# EasyEDA Pro project ProProject_STM32F407IGT6_2024-02-27.epro, schematic Schematic1
Create Date: 2023-11-24; Page Name: P1; Project Name: STM32F407IGT6; Schematic Name: Schematic1; Update Date: 2024-02-21; Company: 嘉立创EDA; Page Size: A3; Version: V1.0
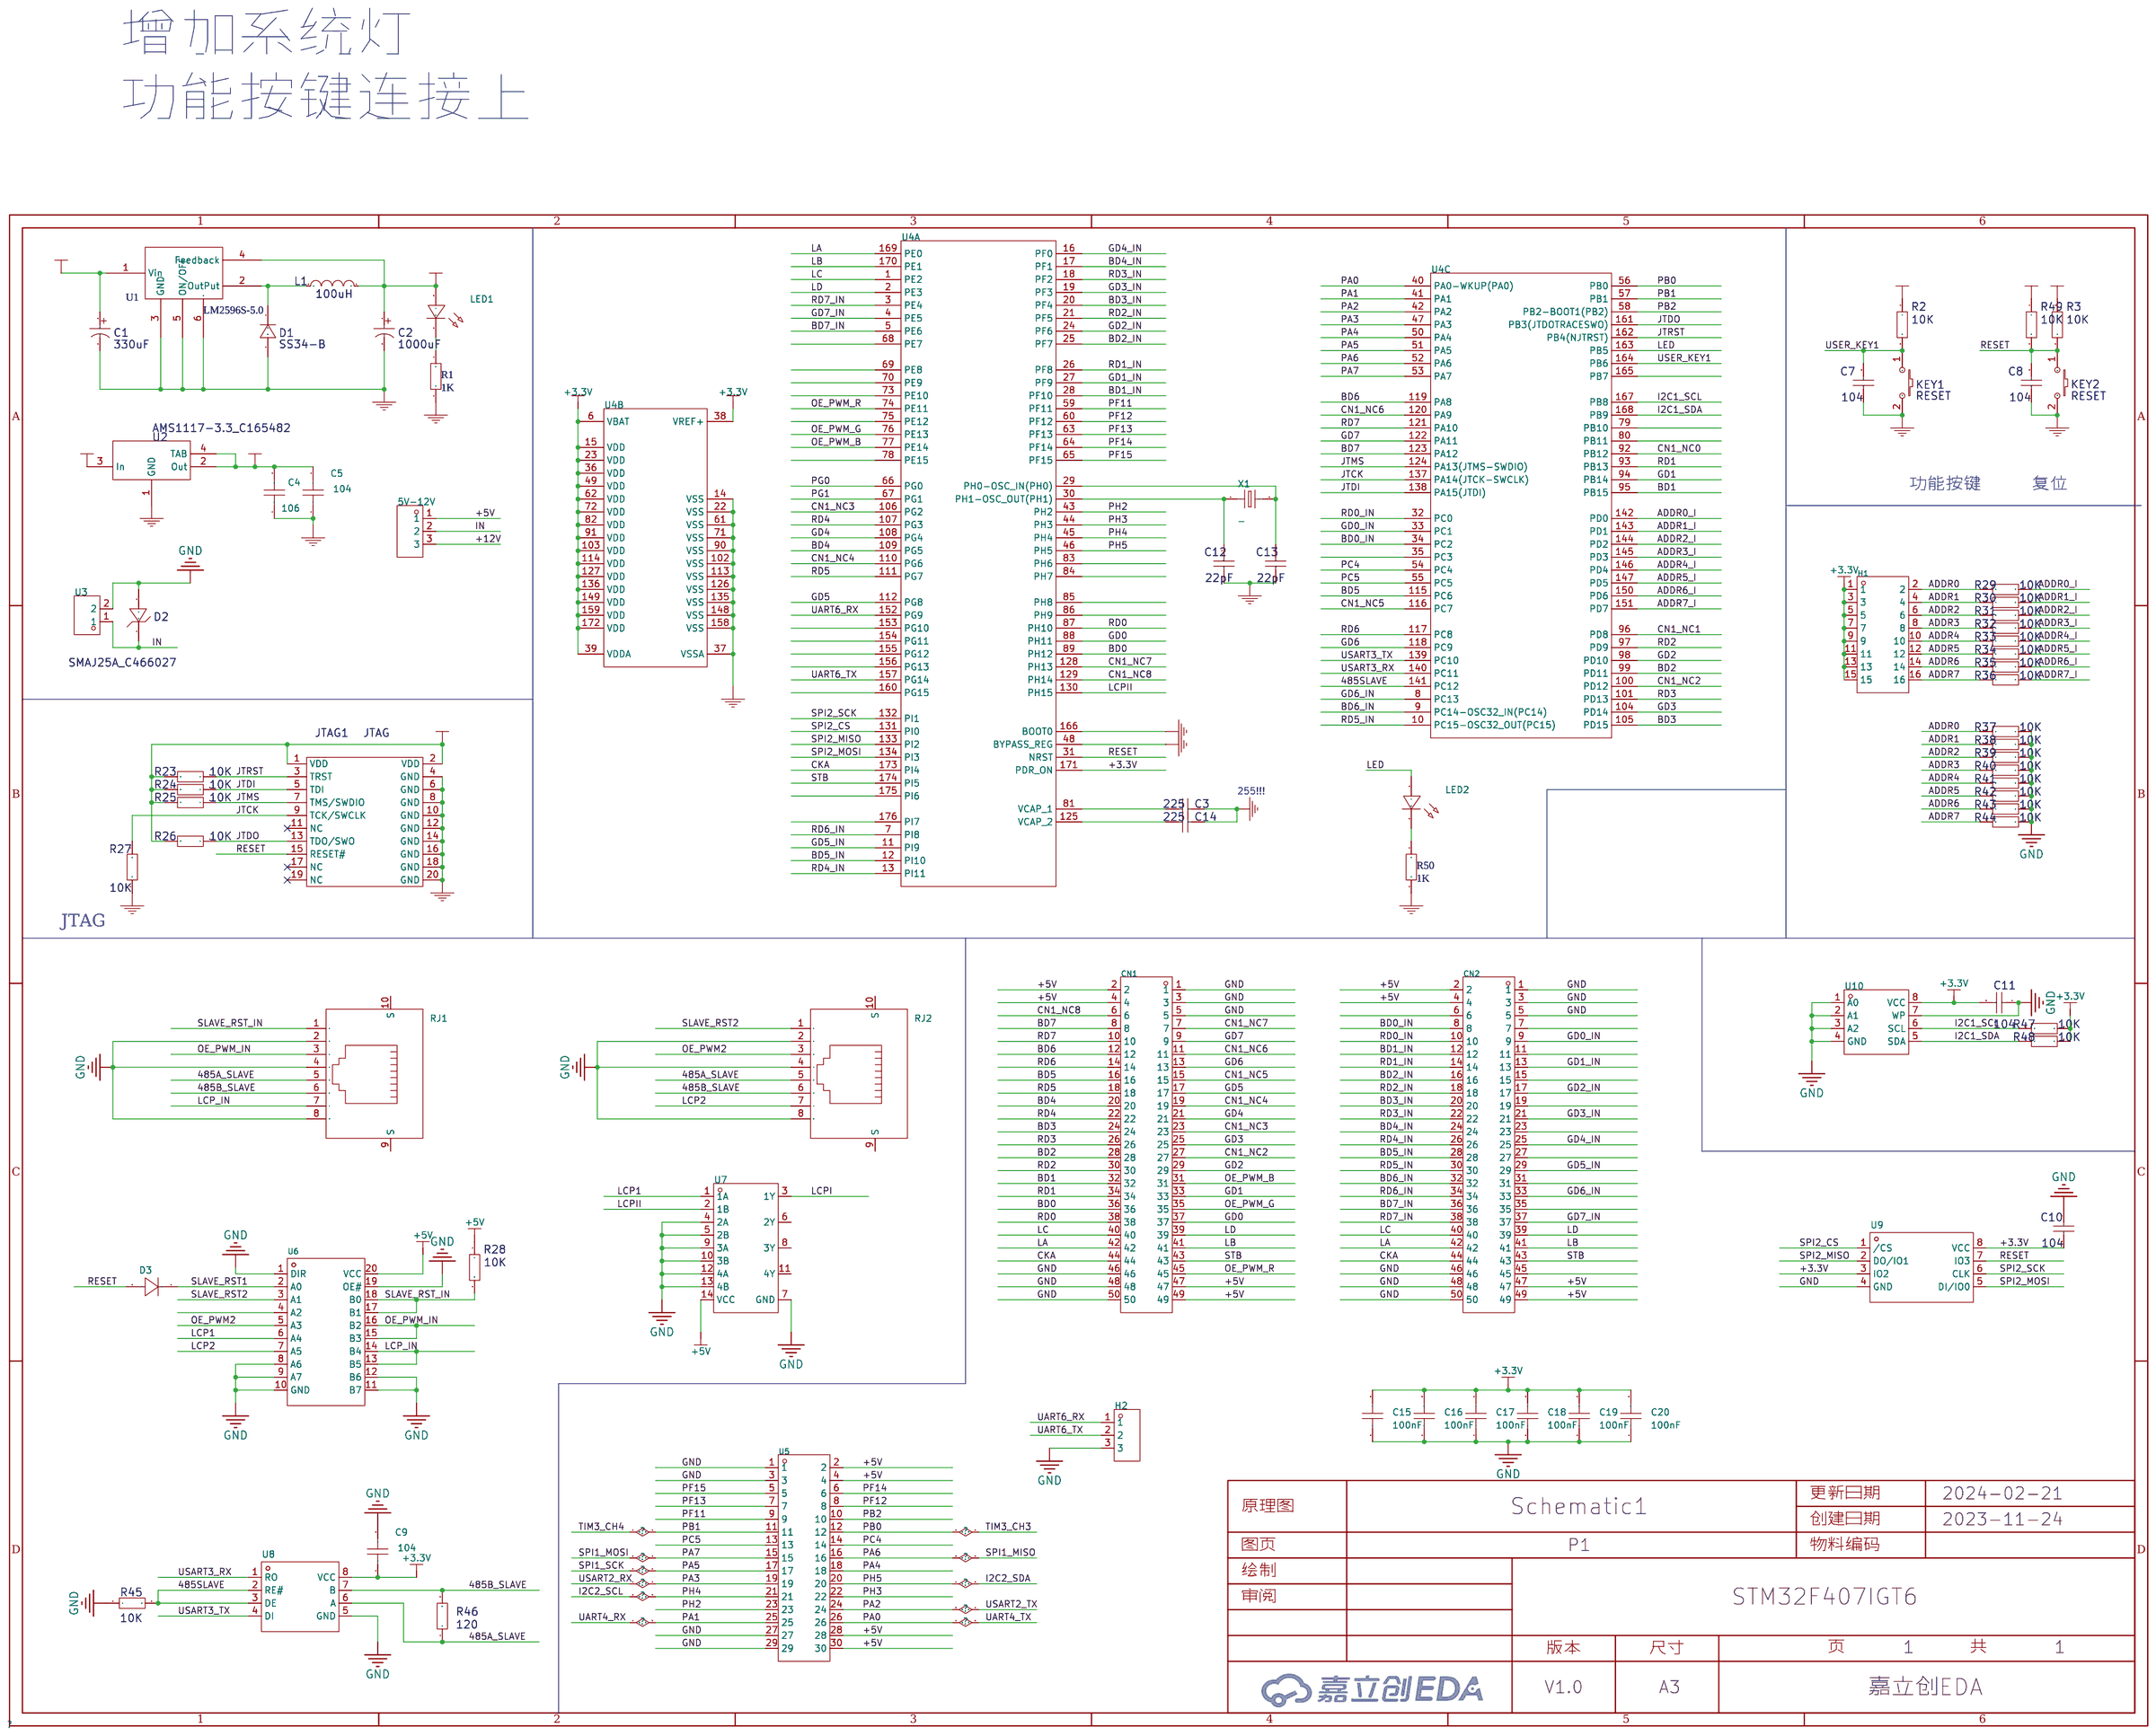
[diagram p0: schematic sheet]

## Parts
5V-12V  -  [HDR-TH_3P-P2.54-V-M]
C1  330uF  [直插电容C1]
C2  1000uF  [直插电容2]
C3  225  [C0805]
C4  106  [C0805]
C5  104  [C0805]
C7  104  [C0805]
C8  104  [C0805]
C9  104  [C0805]
C10  104  [C0805]
C11  104  [C0805]
C12  22pF  [C0805]
C13  22pF  [C0805]
C14  225  [C0805]
C15  100nF  [C0805]
C16  100nF  [C0805]
C17  100nF  [C0805]
C18  100nF  [C0805]
C19  100nF  [C0805]
C20  100nF  [C0805]
CN1  BH-00012  [IDC-TH_BH-00012]
CN2  BH-00012  [IDC-TH_BH-00012]
D1  SS34-B  [SMB_L4.6-W3.6-LS5.3-RD]
D2  SMAJ25A_C466027  [SMA_L4.4-W2.8-LS5.4-RD]
D3  1N4007  [SMA_L4.3-W2.5-LS5.0-RD]
H1  PZ254V-12-16P  [HDR-TH_16P-P2.54-V-M-R2-C8-S2.54]
H2  -  [HDR-TH_3P-P2.54-V-M]
JTAG1  JTAG  [JTAG_20]
KEY1  RESET  [按键]
KEY2  RESET  [按键]
L1  100uH  [IND-SMD_L12.0-W12.0_SLH1207S]
LED1  -  [LED0805-RD_RED]
LED2  -  [LED0805-RD_RED]
R1  1K  [R0805]
R2  10K  [R0805]
R3  10K  [R0805]
R23  10K  [R0805]
R24  10K  [R0805]
R25  10K  [R0805]
R26  10K  [R0805]
R27  10K  [R0805]
R28  10K  [R0805]
R29  10K  [R0805]
R30  10K  [R0805]
R31  10K  [R0805]
R32  10K  [R0805]
R33  10K  [R0805]
R34  10K  [R0805]
R35  10K  [R0805]
R36  10K  [R0805]
R37  10K  [R0805]
R38  10K  [R0805]
R39  10K  [R0805]
R40  10K  [R0805]
R41  10K  [R0805]
R42  10K  [R0805]
R43  10K  [R0805]
R44  10K  [R0805]
R45  10K  [R0805]
R46  120  [R0805]
R47  10K  [R0805]
R48  10K  [R0805]
R49  10K  [R0805]
R50  1K  [R0805]
RJ1  R-RJ45R10P-B000  [RJ45-TH_R-RJ45R10P-B000]
RJ2  R-RJ45R10P-B000  [RJ45-TH_R-RJ45R10P-B000]
U1  LM2596S-5.0  [TO-263-5_L10.6-W9.6-P1.70-LS15.9-BR]
U2  AMS1117-3.3_C165482  [SOT-223_L6.5-W3.5-P2.30-LS7.0-BR]
U3  KF7.62-2P  [CONN-TH_2P-P7.62_KEFA_KF7.62-2P]
U4  STM32F407IET6  [LQFP-176_L24.0-W24.0-P0.50-LS26.0-BL]  (sections 1,2,3)
U5  ZX-IDC2.54-2-15PZZ  [IDC-TH_30P-P2.54_ZX-IDC2.54-2-15PZZ]
U6  74HC245D,653  [SOIC-20_L13.0-W7.6-P1.27-LS10.3-BL]
U7  74HC32D  [SOIC-14_L8.6-W3.8-P1.27-LS6.0-BL]
U8  MAX3485EESA+T  [SOIC-8_L4.9-W3.9-P1.27-LS6.0-BL]
U9  W25Q16JVSSIQ  [SOIC-8_L5.3-W5.3-P1.27-LS8.0-BL]
U10  AT24C02  [SOP-8_L5.0-W4.0-P1.27-LS6.0-BL]
X1  -  [HC-49US_L11.5-W4.5-P4.88]

## Library data of the parts
5V-12V H2 = HDR-M_2.54_1x3P: Supplier Part: C2937625; Supplier Footprint: 插件
C1 = 330uF
C2 = 1000uF
C3 C14 = 225
C4 C5 C9 = CAP_0805: 容值:100nF;精度:±10%;额定电压:50V;温度系数:X7R;; Supplier Footprint: 0805
C7 C8 C10 C11 = 104
C12 C13 = 22
C15-C20 = CAP_0805: Supplier Footprint: 0805
CN1 CN2 = BH-00012: 连接器类型:简牛座;间距:2.54mm;每排PIN数:25;排数:2;行距:2.54mm;封装形式:直插;额定电流:3A;额定电压:-;工作温度范围:-40℃~+105℃;; LCSC Part Name: 2.54mm 每排P数:25 排数:2; Supplier Part: C2685056; Manufacturer: Liansheng(连盛); Supplier Footprint: 直插,P=2.54mm; JLCPCB Part Class: 扩展库; Supplier: LCSC; Connector Type: 简牛座; Pitch: 2.54mm; Pin Number in each Row: 25; Number of Rows: 2; Row Spacing: 2.54mm; Holder Type: 直插; Current Rating (Max): 3A; Operating Temperature Range: -40℃~+105℃
D1 = SS34-B
D2 = SMAJ36A_C466027
D3 = 1N4007_C727081: 二极管配置:独立式;正向压降(Vf):1.1V@1A;直流反向耐压(Vr):1kV;平均整流电流(Io):1A;; LCSC Part Name: 电压:1kV 电流:1A; Supplier Part: C727081; Manufacturer: TWGMC(台湾迪嘉); Supplier Footprint: SMA(DO-214AC); JLCPCB Part Class: Extended Part; Datasheet: https://atta.szlcsc.com/upload/public/pdf/source/20200828/C727079_3A05254382567072883400655AE0ED46.pdf; Supplier: LCSC; Diode Configuration: 独立式; Forward Voltage (Vf@If): 1.1V@1A; Reverse Voltage (Vr): 1kV; Average Rectified Current (Io): 1A; Reverse Leakage Current: 5uA@1kV
H1 = PZ254V-12-16P: 排数:双排;总PIN位数:16P;间距:2.54mm;插针结构:2x8P;行距:2.54mm;安装类型:直插;圆针/方针:方针;额定电流:-;额定电压:-;配合针长度:6mm;塑高:2.5mm;端接针长度:3mm;触头材质:黄铜;触头镀层:-;工作温度范围:-40℃~+105℃;颜色:黑色;; LCSC Part Name: 2.54mm 2x8P 直插 方针; Supplier Part: C492425; Manufacturer: XFCN(兴飞); Supplier Footprint: 插件,P=2.54mm; JLCPCB Part Class: Extended Part; Datasheet: https://atta.szlcsc.com/upload/public/pdf/source/20200309/C492425_0A00EE06259AD0A0AB9C88167BB69964.pdf; Supplier: LCSC; Number of Rows: 双排; Number of Pins: 16P; Pitch: 2.54mm; Pin Structure: 2x8P; Row Spacing: 2.54mm; Mounting Type: 直插; Circluar Pins/Square Pins: 方针; Length of Mating Pin: 6mm; Insulation Height: 2.5mm; Length of End Connection Pin: 3mm; Contact Material: 黄铜; Operating Temperature Range: -40℃~+105℃; Color: 黑色
JTAG1 = JTAG
KEY1 KEY2 = RESET: 制造商: 韩国韩荣
L1 = 100uH
LED1 LED2 = LED_0805-G: Supplier Footprint: 0805
R1 R50 = 1K: Published: 8-Jun-2000; LatestRevisionDate: 17-Jul-2002; LatestRevisionNote: Re-released for DXP Platform.; PackageReference: AXIAL-0.4; Publisher: Altium Limited
R2 R3 R23-R49 = 10K
RJ1 RJ2 = R-RJ45R10P-B000: 连接器类型:RJ插座;USOC代码:RJ45;端口数量:1;等级:-;安装方式:弯插;屏蔽:有屏蔽;LED:不带LED;工作温度范围:0℃~+70℃;; LCSC Part Name: RJ45 弯插 不带LED 10P/8C 铜壳带屏蔽 长体  无弹片 8PIN; Supplier Part: C386758; Manufacturer: Ckmtw(灿科盟); Supplier Footprint: 插件; JLCPCB Part Class: 扩展库; Datasheet: https://atta.szlcsc.com/upload/public/pdf/source/20190508/C386758_8CEE26A838080B089F94E7884BE94734.pdf; Supplier: LCSC; Connector Type: RJ插座; USOC Codes: RJ45; Number of Ports: 1; Mounting Style: 弯插; Shielding: 有屏蔽; LED: 不带LED; Operating Temperature Range: 0℃~+70℃
U1 = LM2596S-5.0
U2 = AMS1117-3.3_C165482
U3 = KF7.62-2P_C5173665: LCSC Part Name: 绿色尼龙环保; Supplier Part: C5173665; Manufacturer: KEFA(科发); Supplier Footprint: 插件,P=7.62mm; JLCPCB Part Class: Extended Part; Datasheet: https://atta.szlcsc.com/upload/public/pdf/source/20220915/0842C98F0805CE3BBD42ED115252704B.pdf; Supplier: LCSC
U4 = STM32F407IET6: CPU内核:ARM Cortex-M4;CPU最大主频:168MHz;程序存储容量:512KB;程序存储器类型:FLASH;RAM总容量:192KB;GPIO端口数量:140;; LCSC Part Name: ARM Cortex-M4 168MHz; Supplier Part: C96313; Manufacturer: ST(意法半导体); Supplier Footprint: LQFP-176(24x24); JLCPCB Part Class: 扩展库; Datasheet: https://atta.szlcsc.com/upload/public/pdf/source/20170707/1499421610637.pdf; Supplier: LCSC; CPU Core: ARM Cortex-M4; CPU Maximum Speed: 168MHz; Operating Voltage Range: 1.8V~3.6V; Program Storage Size: 512KB; Program Memory Type: FLASH; RAM Size: 192KB; GPIO Ports Number: 140; ADC (Bit): 12bit; DAC (Bit): 12bit; Universal Serial Bus: 有; Peripheral/Function: DMA；LCD/LED驱动; Watchdog: 有; Infrared Data Association: 有; Low-Voltage Detect: 有; LCD Module: 有; Direct Memory Access: 有; Internal Oscillator: 有; Operating Temperature Range: -40℃~+85℃
U5 = ZX-IDC2.54-2-15PZZ: 连接器类型:简牛座;间距:2.54mm;结构:2x15P;额定电流:3A;额定电压:1kV;封装形式:直插;行距:2.54mm;排数:2;每排PIN数:15;触头材质:黄铜;触头镀层:金;工作温度范围:-40℃~+105℃;焊接温度(最大值):260℃@10S;; LCSC Part Name: 2.54mm 2x15P 排数:2 每排P数:15; Supplier Part: C7501248; Manufacturer: Megastar(兆星); Supplier Footprint: 插件,P=2.54mm; Datasheet: https://atta.szlcsc.com/upload/public/pdf/source/20231122/459F800AA0F2D58DBB272BCD842D4D41.pdf; Supplier: LCSC; Connector Type: 简牛座; Pitch: 2.54mm; Structure: 2x15P; Current Rating (Max): 3A; Voltage Rating (Max): 1kV; Holder Type: 直插; Row Spacing: 2.54mm; Number of Rows: 2; Pin Number in each Row: 15; Contact Material: 黄铜; Contact Plating: 金; Operating Temperature Range: -40℃~+105℃; Soldering Temperature(Max): 260℃@10S
U6 = 74HC245D,653: 型号中的数字quot;653quot;只是厂家内部的一个编号而已。74HC245D商城上的图片产地仅供参考，以实际供货为准。; Supplier Part: C5625; Manufacturer: Nexperia(安世); Supplier Footprint: SOP-20-300mil; JLCPCB Part Class: 扩展库; Datasheet: https://atta.szlcsc.com/upload/public/pdf/source/20180326/C70245_56281BCF84F9E7641D2BBB6A629E618A.pdf; Supplier: LCSC
U7 = 74HC32D: 逻辑类型:或门;通道数:4;电源电压:2V~6V;静态电流(最大值):1uA;最大传播延迟:13ns@6V,50pF;; Supplier Part: C4468690; Manufacturer: TOSHIBA(东芝); Supplier Footprint: SOP-14; JLCPCB Part Class: 扩展库; Supplier: LCSC; Series: 74HC; Logic Gate Type: 或门; Number of Channels: 4; Supply Voltage: 2V~6V; Quiescent Current (Max): 1uA; Sink Current: 5.2mA; Source Current: 5.2mA; High Level Range (VIH): 1.5V~4.2V; Low Level Range (VIL): 500mV~1.8V; Propagation Delay Time: 13ns@6V,50pF; Operating Temperature: -40℃~+125℃
U8 = MAX3485EESA+T: 类型:收发器;驱动器/接收器:1/1;数据速率:12Mbps;; LCSC Part Name: 3.3V供电 12Mbps 收发器; Supplier Part: C9943; Manufacturer: ADI(亚德诺)/MAXIM(美信); Supplier Footprint: SOP-8; JLCPCB Part Class: Extended Part; Datasheet: https://atta.szlcsc.com/upload/public/pdf/source/20121117/1457706559058.pdf; Supplier: LCSC; Types: 收发器; Driver/receiver: 1/1; Data Rate: 12Mbps; Supply Voltage: 3V~3.6V; Operating Temperature: -40℃~+85℃
U9 = W25Q16JVSSIQ: 接口类型:SPI;存储容量:16Mbit;; Supplier Part: C82317; Manufacturer: WINBOND(华邦); Supplier Footprint: SOIC-8-208mil; JLCPCB Part Class: Extended Part; Datasheet: https://atta.szlcsc.com/upload/public/pdf/source/20210318/C131025_490139441AABAB3970D06D5A0D9163A5.pdf; Supplier: LCSC; Interface Type: SPI; Memory Size: 16Mbit; Supply Voltage: 2.7V~3.6V; Page Programming Time (Tpp): 3ms; Operating Temperature: -40℃~+85℃
U10 = AT24C02_C688857: Supplier Part: C688857; Manufacturer: IDCHIP(英锐芯); Supplier Footprint: SOP-8; JLCPCB Part Class: Extended Part; Datasheet: https://atta.szlcsc.com/upload/public/pdf/source/20200619/C688857_168265888F77B455D6D4136881F4BB15.pdf; Supplier: LCSC
X1 = XIHCELNANF-25MHZ: 晶振类型:-;频率:-;频率公差:-;负载电容:-;工作温度:-;; LCSC Part Name: 25MHZ 20PF30PPM -40~+85DIP; Supplier Part: C295079; Manufacturer: TAITIEN(泰艺电子); Supplier Footprint: HC-49S-2P; JLCPCB Part Class: Extended Part; Datasheet: https://atta.szlcsc.com/upload/public/pdf/source/20180928/C295079_2C551BCED97315E6FEC0145316AF7D5F.pdf; Supplier: LCSC

## Nets
+3.3V: C4.2 C5.2 C9.1 C10.2 C11.2 C15.2 C16.2 C17.2 C18.2 C19.2 C20.2 H1.1 H1.3 H1.5 H1.7 H1.9 H1.11 H1.13 H1.15 JTAG1.1(VDD) JTAG1.2(VDD) R2.1 R3.1 R23.2 R24.2 R25.2 R26.2 R47.2 R48.2 R49.1 U2.2(Out) U2.4(TAB) U4.6(VBAT) U4.15(VDD) U4.23(VDD) U4.36(VDD) U4.38(VREF+) U4.39(VDDA) U4.49(VDD) U4.62(VDD) U4.72(VDD) U4.82(VDD) U4.91(VDD) U4.103(VDD) U4.114(VDD) U4.127(VDD) U4.136(VDD) U4.149(VDD) U4.159(VDD) U4.171(PDR_ON) U4.172(VDD) U8.8(VCC) U9.3(IO2) U9.8(VCC) U10.8(VCC)
+5V: 5V-12V.1 C2.1 CN1.2 CN1.4 CN1.47 CN1.49 CN2.2 CN2.4 CN2.47 CN2.49 L1.2 LED1.2(A) R28.1 U1.4(Feedback) U2.3(In) U5.2 U5.4 U5.28 U5.30 U6.20(VCC) U7.14(VCC)
+12V: 5V-12V.3 C1.1 U1.1(Vin)
GND: C1.2 C2.2 C3.1 C4.1 C5.1 C7.2 C8.2 C9.2 C10.1 C11.1 C12.1 C13.1 C14.1 C15.1 C16.1 C17.1 C18.1 C19.1 C20.1 CN1.1 CN1.3 CN1.5 CN1.46 CN1.48 CN1.50 CN2.1 CN2.3 CN2.5 CN2.46 CN2.48 CN2.50 D1.2 D2.2(A) H2.3 JTAG1.4(GND) JTAG1.6(GND) JTAG1.8(GND) JTAG1.10(GND) JTAG1.12(GND) JTAG1.14(GND) JTAG1.16(GND) JTAG1.18(GND) JTAG1.20(GND) KEY1.2 KEY2.2 R1.2 R27.2 R37.2 R38.2 R39.2 R40.2 R41.2 R42.2 R43.2 R44.2 R45.1 R50.2 RJ1.2 RJ1.4 RJ1.8 RJ2.2 RJ2.4 RJ2.8 U1.3(GND) U1.5(ON/OFF) U1.6 U2.1(GND) U3.2 U4.14(VSS) U4.22(VSS) U4.37(VSSA) U4.48(BYPASS_REG) U4.61(VSS) U4.71(VSS) U4.90(VSS) U4.102(VSS) U4.113(VSS) U4.126(VSS) U4.135(VSS) U4.148(VSS) U4.158(VSS) U4.166(BOOT0) U5.1 U5.3 U5.27 U5.29 U6.1(DIR) U6.8(A6) U6.9(A7) U6.10(GND) U6.11(B7) U6.12(B6) U6.19(OE#) U7.4(2A) U7.5(2B) U7.7(GND) U7.9(3A) U7.10(3B) U7.12(4A) U7.13(4B) U8.5(GND) U9.4(GND) U10.1(A0) U10.2(A1) U10.3(A2) U10.4(GND) U10.7(WP)
485A_SLAVE: R46.1 RJ1.5 RJ2.5 U8.6(A)
485B_SLAVE: R46.2 RJ1.6 RJ2.6 U8.7(B)
485SLAVE: R45.2 U4.141(PC12) U8.2(RE#) U8.3(DE)
ADDR0: H1.2 R29.1 R37.1
ADDR0_I: R29.2 U4.142(PD0)
ADDR1: H1.4 R30.1 R38.1
ADDR1_I: R30.2 U4.143(PD1)
ADDR2: H1.6 R31.1 R39.1
ADDR2_I: R31.2 U4.144(PD2)
ADDR3: H1.8 R32.1 R40.1
ADDR3_I: R32.2 U4.145(PD3)
ADDR4: H1.10 R33.1 R41.1
ADDR4_I: R33.2 U4.146(PD4)
ADDR5: H1.12 R34.1 R42.1
ADDR5_I: R34.2 U4.147(PD5)
ADDR6: H1.14 R35.1 R43.1
ADDR6_I: R35.2 U4.150(PD6)
ADDR7: H1.16 R36.1 R44.1
ADDR7_I: R36.2 U4.151(PD7)
BD0: CN1.36 U4.89(PH12)
BD0_IN: CN2.8 U4.34(PC2)
BD1: CN1.32 U4.95(PB15)
BD1_IN: CN2.12 U4.28(PF10)
BD2: CN1.28 U4.99(PD11)
BD2_IN: CN2.16 U4.25(PF7)
BD3: CN1.24 U4.105(PD15)
BD3_IN: CN2.20 U4.20(PF4)
BD4: CN1.20 U4.109(PG5)
BD4_IN: CN2.24 U4.17(PF1)
BD5: CN1.16 U4.115(PC6)
BD5_IN: CN2.28 U4.12(PI10)
BD6: CN1.12 U4.119(PA8)
BD6_IN: CN2.32 U4.9(PC14-OSC32_IN(PC14))
BD7: CN1.8 U4.123(PA12)
BD7_IN: CN2.36 U4.5(PE6)
CKA: CN1.44 CN2.44 U4.173(PI4)
CN1_NC0: U4.92(PB12)
CN1_NC1: U4.96(PD8)
CN1_NC2: CN1.27 U4.100(PD12)
CN1_NC3: CN1.23 U4.106(PG2)
CN1_NC4: CN1.19 U4.110(PG6)
CN1_NC5: CN1.15 U4.116(PC7)
CN1_NC6: CN1.11 U4.120(PA9)
CN1_NC7: CN1.7 U4.128(PH13)
CN1_NC8: CN1.6 U4.129(PH14)
GD0: CN1.37 U4.88(PH11)
GD0_IN: CN2.9 U4.33(PC1)
GD1: CN1.33 U4.94(PB14)
GD1_IN: CN2.13 U4.27(PF9)
GD2: CN1.29 U4.98(PD10)
GD2_IN: CN2.17 U4.24(PF6)
GD3: CN1.25 U4.104(PD14)
GD3_IN: CN2.21 U4.19(PF3)
GD4: CN1.21 U4.108(PG4)
GD4_IN: CN2.25 U4.16(PF0)
GD5: CN1.17 U4.112(PG8)
GD5_IN: CN2.29 U4.11(PI9)
GD6: CN1.13 U4.118(PC9)
GD6_IN: CN2.33 U4.8(PC13)
GD7: CN1.9 U4.122(PA11)
GD7_IN: CN2.37 U4.4(PE5)
I2C1_SCL: R47.1 U4.167(PB8) U10.6(SCL)
I2C1_SDA: R48.1 U4.168(PB9) U10.5(SDA)
I2C2_SCL: U4.45(PH4) U5.21
I2C2_SDA: U4.46(PH5) U5.20
IN: 5V-12V.2 D2.1(C) U3.1
JTCK: JTAG1.9(TCK/SWCLK) R27.1 U4.137(PA14(JTCK-SWCLK))
JTDI: JTAG1.5(TDI) R24.1 U4.138(PA15(JTDI))
JTDO: JTAG1.13(TDO/SWO) R26.1 U4.161(PB3(JTDOTRACESWO))
JTMS: JTAG1.7(TMS/SWDIO) R25.1 U4.124(PA13(JTMS-SWDIO))
JTRST: JTAG1.3(TRST) R23.1 U4.162(PB4(NJTRST))
LA: CN1.42 CN2.42 U4.169(PE0)
LB: CN1.41 CN2.41 U4.170(PE1)
LC: CN1.40 CN2.40 U4.1(PE2)
LCP1: U6.6(A4) U7.1(1A)
LCP2: RJ2.7 U6.7(A5)
LCP_IN: RJ1.7 U6.13(B5) U6.14(B4)
LCPI: U7.3(1Y)
LCPII: U4.130(PH15) U7.2(1B)
LD: CN1.39 CN2.39 U4.2(PE3)
LED: LED2.2(A) U4.163(PB5)
OE_PWM2: RJ2.3 U6.5(A3)
OE_PWM_B: CN1.31 U4.77(PE14)
OE_PWM_G: CN1.35 U4.76(PE13)
OE_PWM_IN: RJ1.3 U6.15(B3) U6.16(B2)
OE_PWM_R: CN1.45 U4.74(PE11)
PA0: U4.40(PA0-WKUP(PA0)) U5.26
PA1: U4.41(PA1) U5.25
PA2: U4.42(PA2) U5.24
PA3: U4.47(PA3) U5.19
PA4: U4.50(PA4) U5.18
PA5: U4.51(PA5) U5.17
PA6: U4.52(PA6) U5.16
PA7: U4.53(PA7) U5.15
PB0: U4.56(PB0) U5.12
PB1: U4.57(PB1) U5.11
PB2: U4.58(PB2-BOOT1(PB2)) U5.10
PC4: U4.54(PC4) U5.14
PC5: U4.55(PC5) U5.13
PF11: U4.59(PF11) U5.9
PF12: U4.60(PF12) U5.8
PF13: U4.63(PF13) U5.7
PF14: U4.64(PF14) U5.6
PF15: U4.65(PF15) U5.5
PG0: U4.66(PG0)
PG1: U4.67(PG1)
PH2: U4.43(PH2) U5.23
PH3: U4.44(PH3) U5.22
RD0: CN1.38 U4.87(PH10)
RD0_IN: CN2.10 U4.32(PC0)
RD1: CN1.34 U4.93(PB13)
RD1_IN: CN2.14 U4.26(PF8)
RD2: CN1.30 U4.97(PD9)
RD2_IN: CN2.18 U4.21(PF5)
RD3: CN1.26 U4.101(PD13)
RD3_IN: CN2.22 U4.18(PF2)
RD4: CN1.22 U4.107(PG3)
RD4_IN: CN2.26 U4.13(PI11)
RD5: CN1.18 U4.111(PG7)
RD5_IN: CN2.30 U4.10(PC15-OSC32_OUT(PC15))
RD6: CN1.14 U4.117(PC8)
RD6_IN: CN2.34 U4.7(PI8)
RD7: CN1.10 U4.121(PA10)
RD7_IN: CN2.38 U4.3(PE4)
RESET: C8.1 D3.2(A) JTAG1.15(RESET#) KEY2.1 R3.2 R49.2 U4.31(NRST) U9.7(IO3)
SLAVE_RST1: D3.1(K) U6.2(A0)
SLAVE_RST2: RJ2.1 U6.3(A1)
SLAVE_RST_IN: R28.2 RJ1.1 U6.17(B1) U6.18(B0)
SPI2_CS: U4.131(PI0) U9.1(/CS)
SPI2_MISO: U4.133(PI2) U9.2(DO/IO1)
SPI2_MOSI: U4.134(PI3) U9.5(DI/IO0)
SPI2_SCK: U4.132(PI1) U9.6(CLK)
STB: CN1.43 CN2.43 U4.174(PI5)
UART6_RX: H2.1 U4.152(PG9)
UART6_TX: H2.2 U4.157(PG14)
USART3_RX: U4.140(PC11) U8.1(RO)
USART3_TX: U4.139(PC10) U8.4(DI)
USER_KEY1: C7.1 KEY1.1 R2.2 U4.164(PB6)
$1N10347: D1.1 L1.1 U1.2(OutPut)
$1N11268: C3.2 U4.81(VCAP_1)
$1N11269: C14.2 U4.125(VCAP_2)
$1N14867: LED1.1(C) R1.1
$1N19356: C13.2 U4.29(PH0-OSC_IN(PH0)) X1.2
$1N19357: C12.2 U4.30(PH1-OSC_OUT(PH1)) X1.1
$1N25346: LED2.1(C) R50.1

Not connected (* = marked no-connect by the designer): CN2 6 7 11 15 19 23 27 31 35 45; JTAG1 11(NC)* 17(NC)* 19(NC)*; RJ1 9(S) 10(S); RJ2 9(S) 10(S); U4 35(PC3) 68(PE7) 69(PE8) 70(PE9) 73(PE10) 75(PE12) 78(PE15) 79(PB10) 80(PB11) 83(PH6) 84(PH7) 85(PH8) 86(PH9) 153(PG10) 154(PG11) 155(PG12) 156(PG13) 160(PG15) 165(PB7) 175(PI6) 176(PI7); U6 4(A2); U7 6(2Y) 8(3Y) 11(4Y)

## Notes on the sheet
- 增加系统灯
  功能按键连接上
- 功能按键
- 复位
- 255!!!
- JTAG
